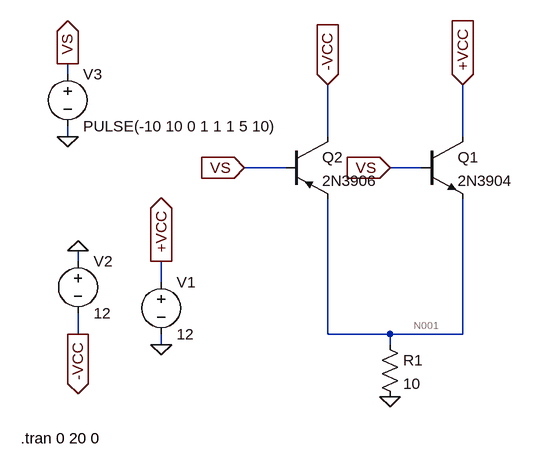
[diagram p0: schematic pilota motore.asc]
pilota motore.asc, the LTspice schematic file:
Version 4
SHEET 1 880 680
WIRE -448 16 -448 0
WIRE -448 112 -448 96
WIRE -48 112 -48 32
WIRE 160 112 160 32
WIRE -112 160 -176 160
WIRE 96 160 48 160
WIRE -432 304 -432 288
WIRE -304 336 -304 304
WIRE -432 416 -432 384
WIRE -48 416 -48 208
WIRE 48 416 -48 416
WIRE 160 416 160 208
WIRE 160 416 48 416
WIRE -304 432 -304 416
WIRE 48 432 48 416
FLAG -304 432 0
FLAG -432 288 0
FLAG -304 304 +VCC
IOPIN -304 304 Out
FLAG -432 416 -VCC
IOPIN -432 416 Out
FLAG 160 32 +VCC
IOPIN 160 32 In
FLAG -48 32 -VCC
IOPIN -48 32 In
FLAG 48 160 VS
IOPIN 48 160 In
FLAG -176 160 VS
IOPIN -176 160 In
FLAG 48 512 0
FLAG -448 112 0
FLAG -448 0 VS
IOPIN -448 0 Out
SYMBOL npn 96 112 R0
SYMATTR InstName Q1
SYMATTR Value 2N3904
SYMBOL pnp -112 112 R0
SYMATTR InstName Q2
SYMATTR Value 2N3906
SYMBOL voltage -304 320 R0
WINDOW 123 0 0 Left 0
WINDOW 39 0 0 Left 0
SYMATTR InstName V1
SYMATTR Value 12
SYMBOL voltage -432 288 R0
WINDOW 123 0 0 Left 0
WINDOW 39 0 0 Left 0
SYMATTR InstName V2
SYMATTR Value 12
SYMBOL res 32 416 R0
SYMATTR InstName R1
SYMATTR Value 10
SYMBOL voltage -448 0 R0
WINDOW 123 0 0 Left 0
WINDOW 39 0 0 Left 0
SYMATTR InstName V3
SYMATTR Value PULSE(-10 10 0 1 1 1 5 10)
TEXT -520 576 Left 0 !.tran 0 20 0

The netlist it stands for:
* pilota motore.asc
Q1 +VCC VS N001 0 2N3904
Q2 -VCC VS N001 0 2N3906
V1 +VCC 0 12
V2 0 -VCC 12
R1 N001 0 10
V3 VS 0 PULSE(-10 10 0 1 1 1 5 10)
.model NPN NPN
.model PNP PNP
.lib standard.bjt
.tran 0 20 0
.backanno
.end

* Results of the author's LTspice run, read from the files saved beside the schematic
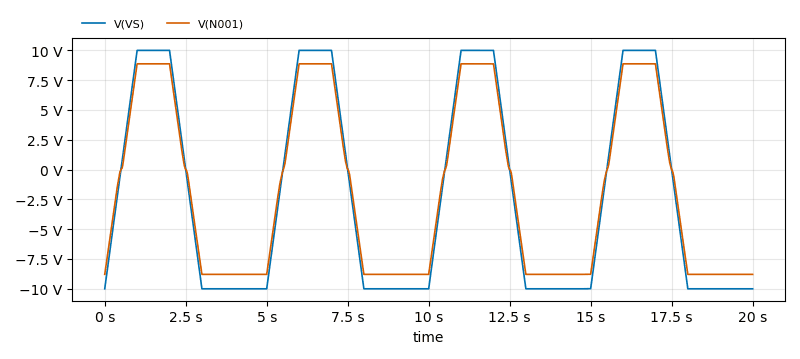
[diagram p1: Transient Analysis of pilota motore.asc, plotted from the saved traces]
* Transient Analysis, 1 run:
*   V(VS): min -10 V, max 10 V, average -2 V, rms 8.598 V, last -10 V
*   V(N001): min -8.789 V, max 8.871 V, average -1.737 V, rms 7.539 V, last -8.789 V